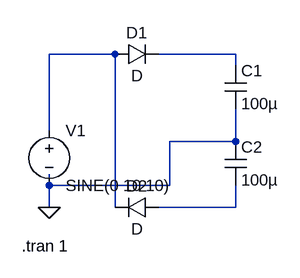
[diagram p0: schematic handdrawn_voltage_multiplier.asc]
handdrawn_voltage_multiplier.asc, the LTspice schematic file:
Version 4.1
SHEET 1 924 680
WIRE 208 -16 112 -16
WIRE 384 -16 272 -16
WIRE 384 0 384 -16
WIRE 112 96 112 -16
WIRE 384 112 384 64
WIRE 384 112 288 112
WIRE 112 176 112 160
WIRE 288 176 288 112
WIRE 288 176 112 176
WIRE 112 208 112 176
WIRE 208 208 208 -16
WIRE 384 208 384 176
WIRE 384 208 272 208
FLAG 112 208 0
SYMBOL voltage 112 80 R0
WINDOW 123 0 0 Left 0
WINDOW 39 0 0 Left 0
SYMATTR InstName V1
SYMATTR Value SINE(0 10 10)
SYMBOL diode 208 0 R270
WINDOW 0 32 32 VTop 2
WINDOW 3 0 32 VBottom 2
SYMATTR InstName D1
SYMBOL cap 368 0 R0
SYMATTR InstName C1
SYMATTR Value 100µ
SYMBOL cap 368 112 R0
SYMATTR InstName C2
SYMATTR Value 100µ
SYMBOL diode 272 192 R90
WINDOW 0 0 32 VBottom 2
WINDOW 3 32 32 VTop 2
SYMATTR InstName D2
TEXT 72 264 Left 2 !.tran 1

The netlist it stands for:
* handdrawn_voltage_multiplier.asc
V1 N001 0 SINE(0 10 10)
D1 N001 N002 D
C1 N002 0 100µ
C2 0 N003 100µ
D2 N003 N001 D
.model D D
.lib standard.dio
.tran 1
.backanno
.end